# Altium schematic sheet M2.SchDoc
size A3; DocumentNumber: 3; SheetNumber: 3; SheetTotal: 8
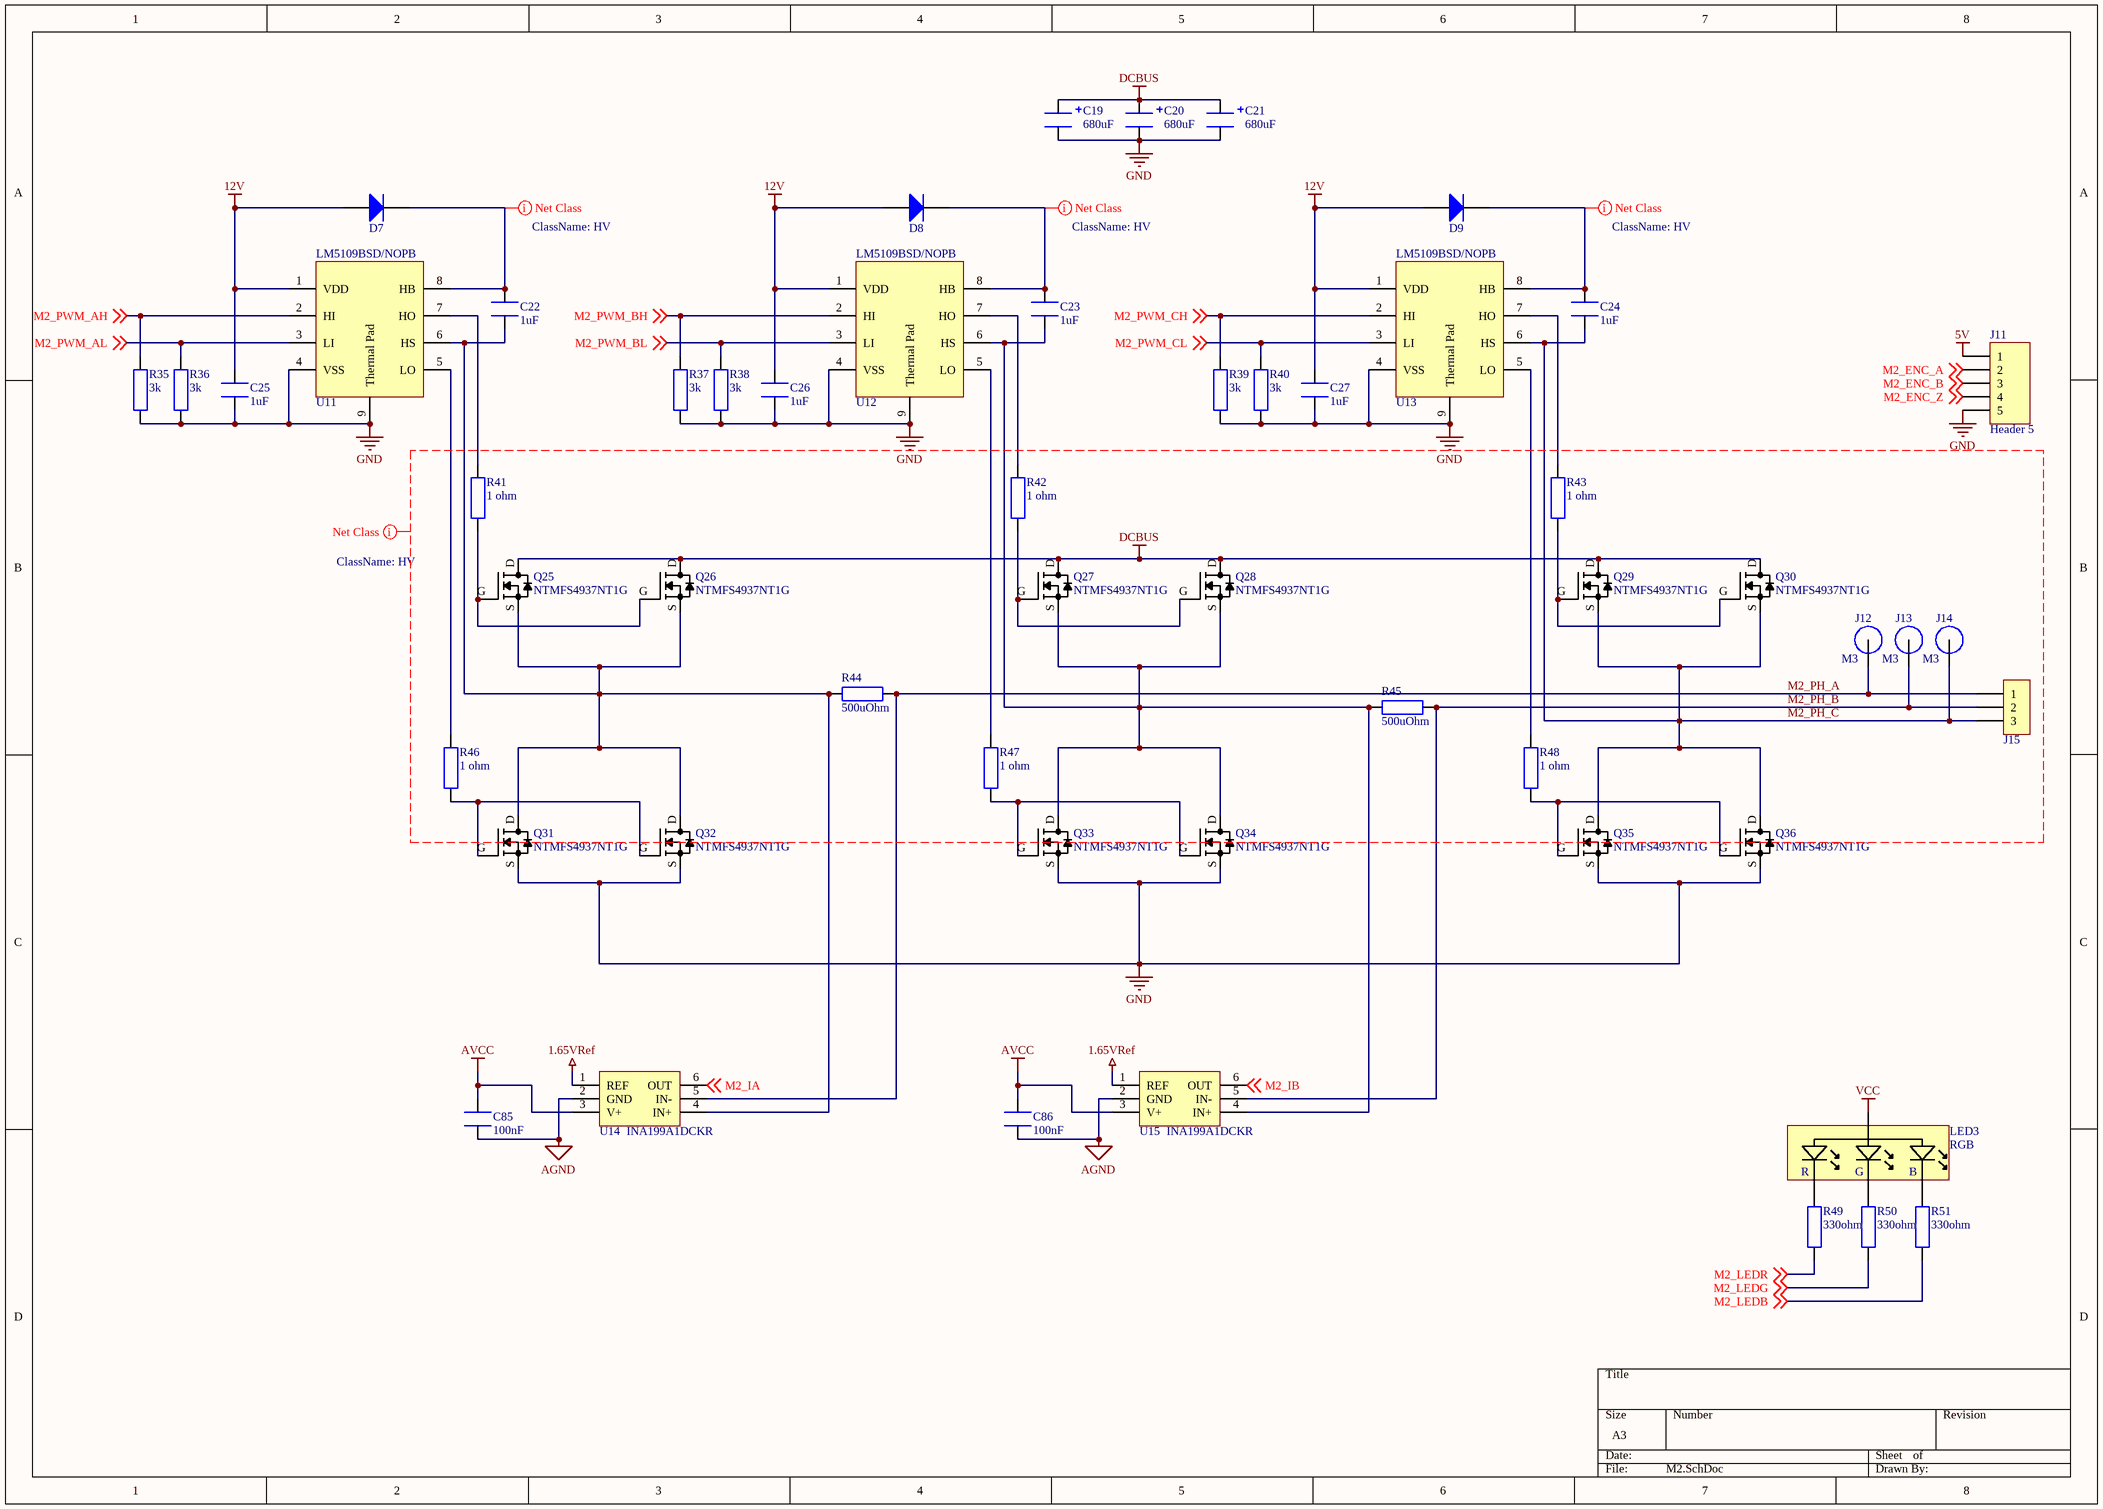
[diagram p0: M2.SchDoc]

## Parts
C19  value 680uF  [CAPE10.0MM_Rad_10x14mm]  (hidden comment: 35ZLH680MEFC10X23)
C20  value 680uF  [CAPE10.0MM_Rad_10x14mm]  (hidden comment: 35ZLH680MEFC10X23)
C21  value 680uF  [CAPE10.0MM_Rad_10x14mm]  (hidden comment: 35ZLH680MEFC10X23)
C22  value 1uF  [1608[0603]]  (hidden comment: MC0603X105K160)
C23  value 1uF  [1608[0603]]  (hidden comment: MC0603X105K160)
C24  value 1uF  [1608[0603]]  (hidden comment: MC0603X105K160)
C25  value 1uF  [1608[0603]]  (hidden comment: MC0603X105K160)
C26  value 1uF  [1608[0603]]  (hidden comment: MC0603X105K160)
C27  value 1uF  [1608[0603]]  (hidden comment: MC0603X105K160)
C85  value 100nF  [1608[0603]]  (hidden comment: MC0603B104K160CT)
C86  value 100nF  [1608[0603]]  (hidden comment: MC0603B104K160CT)
D7  RB521S30T1G  [SOD523F]  (value not drawn)
D8  RB521S30T1G  [SOD523F]  (value not drawn)
D9  RB521S30T1G  [SOD523F]  (value not drawn)
J11  Header 5  [HDR1X5]
J12  M3  [M3 Spade Hole]
J13  M3  [M3 Spade Hole]
J14  M3  [M3 Spade Hole]
J15  MC000051  [MC000051]  (value not drawn)
LED3  RGB  [ASMB-MTB1]
Q25  NTMFS4937NT1G  [SO8FL]
Q26  NTMFS4937NT1G  [SO8FL]
Q27  NTMFS4937NT1G  [SO8FL]
Q28  NTMFS4937NT1G  [SO8FL]
Q29  NTMFS4937NT1G  [SO8FL]
Q30  NTMFS4937NT1G  [SO8FL]
Q31  NTMFS4937NT1G  [SO8FL]
Q32  NTMFS4937NT1G  [SO8FL]
Q33  NTMFS4937NT1G  [SO8FL]
Q34  NTMFS4937NT1G  [SO8FL]
Q35  NTMFS4937NT1G  [SO8FL]
Q36  NTMFS4937NT1G  [SO8FL]
R35  value 3k  [RESC1608X55N]  (hidden comment: MCMR06X3001FTL)
R36  value 3k  [RESC1608X55N]  (hidden comment: MCMR06X3001FTL)
R37  value 3k  [RESC1608X55N]  (hidden comment: MCMR06X3001FTL)
R38  value 3k  [RESC1608X55N]  (hidden comment: MCMR06X3001FTL)
R39  value 3k  [RESC1608X55N]  (hidden comment: MCMR06X3001FTL)
R40  value 3k  [RESC1608X55N]  (hidden comment: MCMR06X3001FTL)
R41  value 1 ohm  [RESC1608X55N]  (hidden comment: MCWR06W1R00FTL)
R42  value 1 ohm  [RESC1608X55N]  (hidden comment: MCWR06W1R00FTL)
R43  value 1 ohm  [RESC1608X55N]  (hidden comment: MCWR06W1R00FTL)
R44  value 500uOhm  [RESC6332X70N]  (hidden comment: TLR3A20DR0005FTDG)
R45  value 500uOhm  [RESC6332X70N]  (hidden comment: TLR3A20DR0005FTDG)
R46  value 1 ohm  [RESC1608X55N]  (hidden comment: MCWR06W1R00FTL)
R47  value 1 ohm  [RESC1608X55N]  (hidden comment: MCWR06W1R00FTL)
R48  value 1 ohm  [RESC1608X55N]  (hidden comment: MCWR06W1R00FTL)
R49  value 330ohm  [RESC1608X55N]  (hidden comment: MCWR06X3300FTL)
R50  value 330ohm  [RESC1608X55N]  (hidden comment: MCWR06X3300FTL)
R51  value 330ohm  [RESC1608X55N]  (hidden comment: MCWR06X3300FTL)
U11  LM5109BSD/NOPB  [SON80P400X80_HS-9N]
U12  LM5109BSD/NOPB  [SON80P400X80_HS-9N]
U13  LM5109BSD/NOPB  [SON80P400X80_HS-9N]
U14  INA199A1DCKR  [TSOP65P210X110-6N]
U15  INA199A1DCKR  [TSOP65P210X110-6N]

## Nets
1.65VRef: U14.1(REF) U15.1(REF)
5V: J11.1
12V: C25.2 C26.2 C27.2 D7.A D8.A D9.A U11.1(VDD) U12.1(VDD) U13.1(VDD)
AGND: C85.1 C86.1 U14.2(GND) U15.2(GND)
AVCC: C85.2 C86.2 U14.3(V+) U15.3(V+)
DCBUS: C19.1 C20.1 C21.1 Q25.D Q26.D Q27.D Q28.D Q29.D Q30.D
GND: C19.2 C20.2 C21.2 C25.1 C26.1 C27.1 J11.5 Q31.S Q32.S Q33.S Q34.S Q35.S Q36.S R35.1 R36.1 R37.1 R38.1 R39.1 R40.1 U11.4(VSS) U11.9(Thermal_Pad) U12.4(VSS) U12.9(Thermal_Pad) U13.4(VSS) U13.9(Thermal_Pad)
VCC: LED3.4(A)
M2_ENC_A: J11.2 ; off-sheet M2_ENC_A
M2_ENC_B: J11.3 ; off-sheet M2_ENC_B
M2_ENC_Z: J11.4 ; off-sheet M2_ENC_Z
M2_IA: U14.6(OUT) ; off-sheet M2_IA
M2_IB: U15.6(OUT) ; off-sheet M2_IB
M2_LEDB: R51.2 ; off-sheet M2_LEDB
M2_LEDG: R50.2 ; off-sheet M2_LEDG
M2_LEDR: R49.2 ; off-sheet M2_LEDR
M2_PH_A: J12.1 J15.1 R44.1 U14.5(IN-)
M2_PH_B: J13.1 J15.2 R45.1 U15.5(IN-)
M2_PH_C: C24.1 J14.1 J15.3 Q29.S Q30.S Q35.D Q36.D U13.6(HS)
M2_PWM_AH: R35.2 U11.2(HI) ; off-sheet M2_PWM_AH
M2_PWM_AL: R36.2 U11.3(LI) ; off-sheet M2_PWM_AL
M2_PWM_BH: R37.2 U12.2(HI) ; off-sheet M2_PWM_BH
M2_PWM_BL: R38.2 U12.3(LI) ; off-sheet M2_PWM_BL
M2_PWM_CH: R39.2 U13.2(HI) ; off-sheet M2_PWM_CH
M2_PWM_CL: R40.2 U13.3(LI) ; off-sheet M2_PWM_CL
NetC22_1: C22.1 Q25.S Q26.S Q31.D Q32.D R44.2 U11.6(HS) U14.4(IN+)
NetC22_2: C22.2 D7.K U11.8(HB)
NetC23_1: C23.1 Q27.S Q28.S Q33.D Q34.D R45.2 U12.6(HS) U15.4(IN+)
NetC23_2: C23.2 D8.K U12.8(HB)
NetC24_2: C24.2 D9.K U13.8(HB)
NetLED3_1: LED3.1(R) R49.1
NetLED3_2: LED3.2(G) R50.1
NetLED3_3: LED3.3(B) R51.1
NetQ25_G: Q25.G Q26.G R41.1
NetQ27_G: Q27.G Q28.G R42.1
NetQ29_G: Q29.G Q30.G R43.1
NetQ31_G: Q31.G Q32.G R46.1
NetQ33_G: Q33.G Q34.G R47.1
NetQ35_G: Q35.G Q36.G R48.1
NetR41_2: R41.2 U11.7(HO)
NetR42_2: R42.2 U12.7(HO)
NetR43_2: R43.2 U13.7(HO)
NetR46_2: R46.2 U11.5(LO)
NetR47_2: R47.2 U12.5(LO)
NetR48_2: R48.2 U13.5(LO)

## Layout directives
net class HV: DCBUS, M2_PH_A, M2_PH_B, M2_PH_C, NetC22_2, NetC23_2, NetC24_2

## Library data of the parts
C19-C21 = 35ZLH680MEFC10X23: CAP, ALU ELEC, 680UF, 35V, RAD; Supplier 1: Farnell; Supplier Part Number 1: 8126771
C22-C27 = MC0603X105K160: CAP, MLCC, X5R, 1UF, 16V, 0603; Supplier 1: Farnell; Supplier Part Number 1: 2310630; Supplier 2: Farnell; Supplier Part Number 2: 1759407RL; Supplier 3: Farnell; Supplier Part Number 3: 1759407
C85 C86 = MC0603B104K160CT: CAP, MLCC, X7R, 100NF, 16V, 0603; Supplier 1: Farnell; Supplier Part Number 1: 2310628; Supplier 2: Farnell; Supplier Part Number 2: 1759016RL; Supplier 3: Farnell; Supplier Part Number 3: 1759016
D7-D9 = RB521S30T1G: DIODE, SCHOTTKY, 200MA, 30V; Supplier 1: Farnell; Supplier Part Number 1: 2317433
J11 = Header 5: Header, 5-Pin; LatestRevisionDate: 17-Jul-2002; LatestRevisionNote: Re-released for DXP Platform.; Publisher: Altium Limited
J12-J14 = M3 Spade Terminal
J15 = MC000051: TERMINAL BLOCK, WIRE TO BRD, 3POS, 10AWG; Supplier 1: Farnell; Supplier Part Number 1: 2008022
LED3 = ASMB-MTB1-0A3A2: LED, HB, RGB, 0.09W, PLCC-4; Supplier 1: Farnell; Supplier Part Number 1: 2401106
Q25-Q36 = NTMFS4937NT1G: MOSFET, N CH, 30V, 70A, SO-8 FL; Supplier 1: Farnell; Supplier Part Number 1: 2317605; Supplier 2: Farnell; Supplier Part Number 2: 2317605RL
R35-R40 = MCMR06X3001FTL: RESISTOR, 0603, 3K, 1%, ANTI SULFUR; Supplier 1: Farnell; Supplier Part Number 1: 2073461; Supplier 2: Farnell; Supplier Part Number 2: 2073461RL
R41-R43 R46-R48 = MCWR06W1R00FTL: RES, THICK FILM, 1OHM, 1%, 0.1W; Supplier 1: Farnell; Supplier 2: Farnell; Supplier Part Number 1: 2447289; Supplier Part Number 2: 2447289RL
R44 R45 = TLR3A20DR0005FTDG: RESISTOR, R0005, 2.0W, 1%
R49-R51 = MCWR06X3300FTL: RES, THICK FILM, 330 OHM, 1%, 0.1W; Supplier 1: Farnell; Supplier Part Number 1: 2447339RL; Supplier 2: Farnell; Supplier Part Number 2: 2446656; Supplier 3: Farnell; Supplier Part Number 3: 2447339
U11-U13 = LM5109BSD/NOPB: DRIVER, MOSFET, HALF BRIDGE, WSON-8, 1A; Supplier 1: Farnell; Supplier Part Number 1: 2400642RL; Supplier 2: Farnell; Supplier Part Number 2: 2400642; Supplier 3: Farnell; Supplier Part Number 3: 2382850
U14 U15 = INA199A1DCKR: CURRENT SENSE AMP, 50V/V, 80KHZ; Supplier 1: Digi-Key; Supplier Part Number 1: 296-27329-1-ND; Supplier 2: Mouser; Supplier Part Number 2: 595-INA199B1DCKT